# EAGLE design EFM_VCF_4622 (EAGLE 7.1.0)
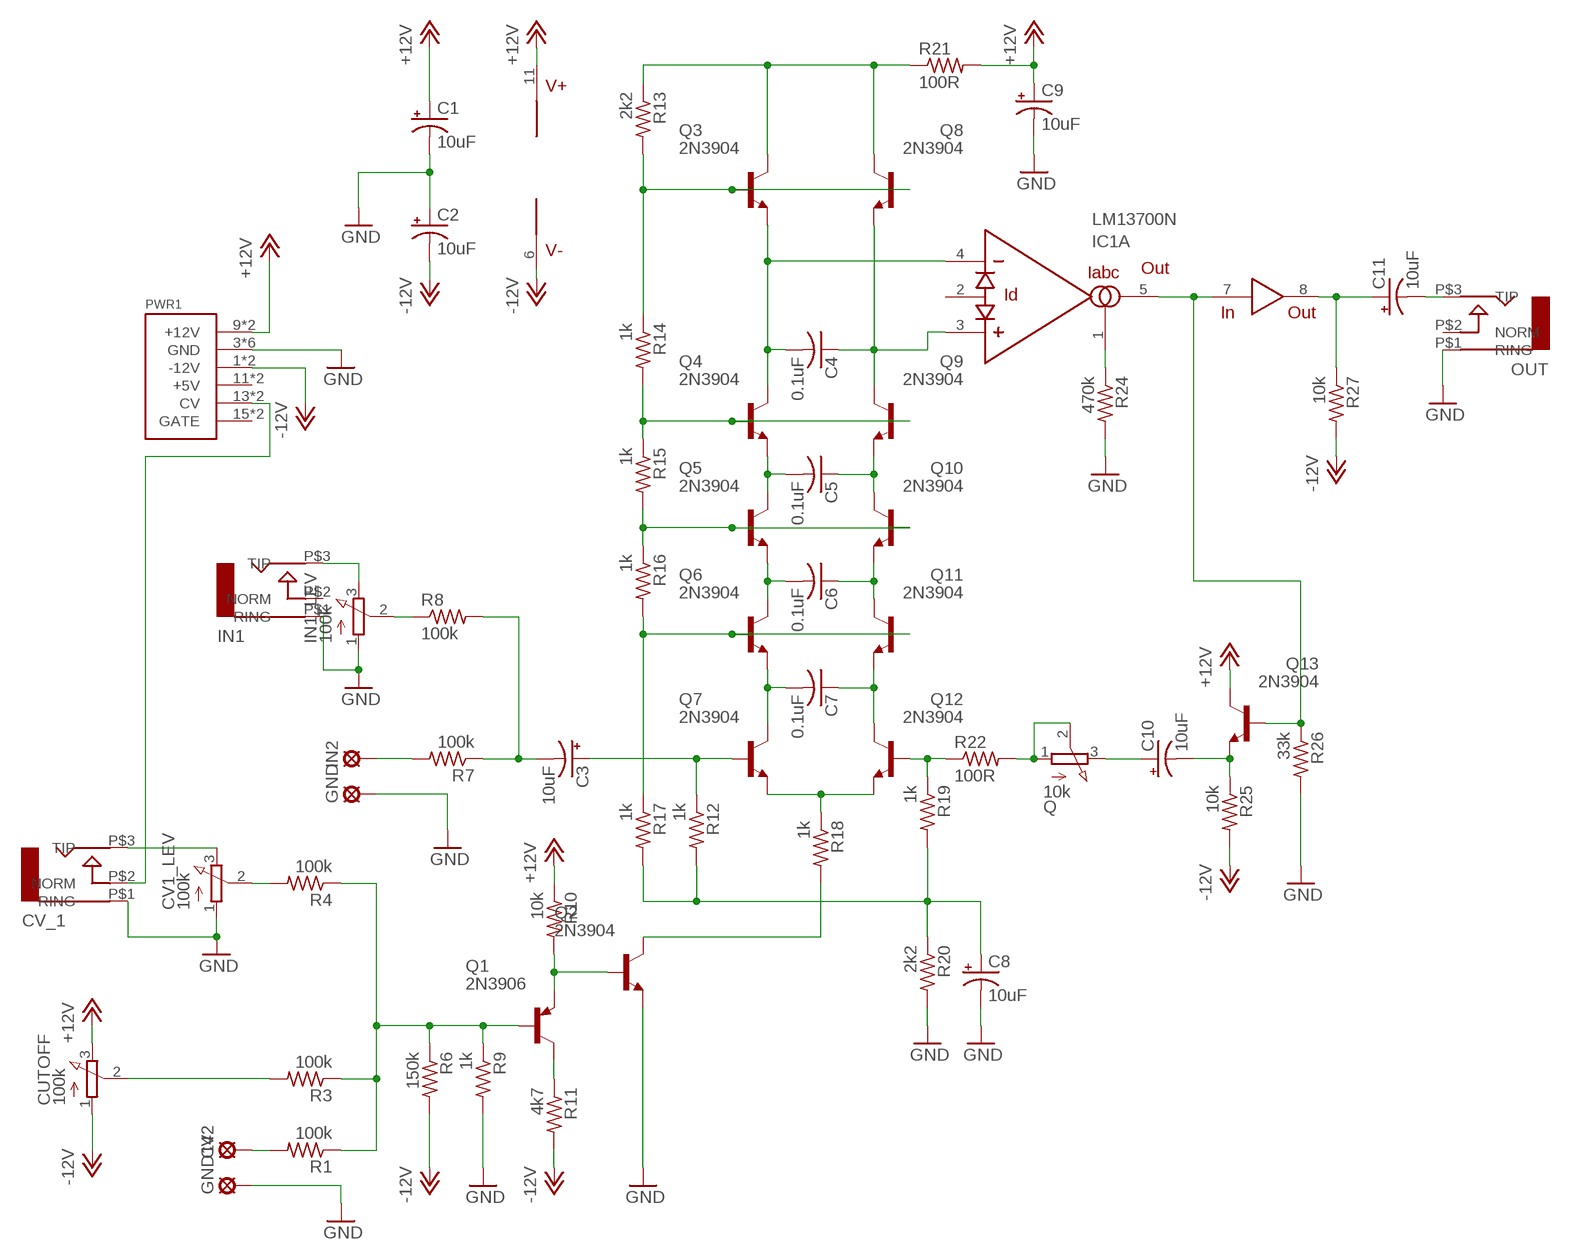
[diagram p0: schematic, sheet 1]

## Parts
C1  10uF  CPOL-USB45181A  [B45181A]
C2  10uF  CPOL-USB45181A  [B45181A]
C3  10uF  CPOL-USB45181A  [B45181A]
C4  0.1uF  C-US050-025X075  [C050-025X075]
C5  0.1uF  C-US050-025X075  [C050-025X075]
C6  0.1uF  C-US050-025X075  [C050-025X075]
C7  0.1uF  C-US050-025X075  [C050-025X075]
C8  10uF  CPOL-USB45181A  [B45181A]
C9  10uF  CPOL-USB45181A  [B45181A]
C10  10uF  CPOL-USB45181C  [B45181C]
C11  10uF  CPOL-USB45181B  [B45181B]
CUTOFF  100k  3RP/1610N  [3RP/1610N]
CV1_LEV  100k  3RP/1610N  [3RP/1610N]
CV2  LSP10  [LSP10]
CV_1  AUDIO-JACK  [ERTHENVAR-JACK-90DEG]
GND  LSP10  [LSP10]
GND14  LSP10  [LSP10]
IC1  LM13700N  [DIL16]
IN1  AUDIO-JACK  [ERTHENVAR-JACK-90DEG]
IN1_LEV  100k  3RP/1610N  [3RP/1610N]
IN2  LSP10  [LSP10]
OUT  AUDIO-JACK  [ERTHENVAR-JACK-90DEG]
PWR1  POWER  [POWER_16]
Q  10k  3RP/1610N  [3RP/1610N]
Q1  2N3906  [TO92]
Q2  2N3904  [TO92]
Q3  2N3904  [TO92]
Q4  2N3904  [TO92]
Q5  2N3904  [TO92]
Q6  2N3904  [TO92]
Q7  2N3904  [TO92]
Q8  2N3904  [TO92]
Q9  2N3904  [TO92]
Q10  2N3904  [TO92]
Q11  2N3904  [TO92]
Q12  2N3904  [TO92]
Q13  2N3904  [TO92]
R1  100k  R-US_0207/7  [0207/7]
R3  100k  R-US_0207/7  [0207/7]
R4  100k  R-US_0207/7  [0207/7]
R6  150k  R-US_0207/7  [0207/7]
R7  100k  R-US_0207/7  [0207/7]
R8  100k  R-US_0207/7  [0207/7]
R9  1k  R-US_0207/7  [0207/7]
R10  10k  R-US_0207/7  [0207/7]
R11  4k7  R-US_0207/7  [0207/7]
R12  1k  R-US_0207/7  [0207/7]
R13  2k2  R-US_0207/7  [0207/7]
R14  1k  R-US_0207/7  [0207/7]
R15  1k  R-US_0207/7  [0207/7]
R16  1k  R-US_0207/7  [0207/7]
R17  1k  R-US_0207/7  [0207/7]
R18  1k  R-US_0207/7  [0207/7]
R19  1k  R-US_0207/7  [0207/7]
R20  2k2  R-US_0207/7  [0207/7]
R21  100R  R-US_0207/7  [0207/7]
R22  100R  R-US_0207/7  [0207/7]
R24  470k  R-US_0207/7  [0207/7]
R25  10k  R-US_0207/7  [0207/7]
R26  33k  R-US_0207/7  [0207/7]
R27  10k  R-US_0207/7  [0207/7]

## Nets
+12V: C1.+ C9.+ CUTOFF.3(E) IC1.11(V+) PWR1.9(+12V) PWR1.10(+12V) Q13.1(C) R10.1 R21.2
-12V: C2.- CUTOFF.1(A) IC1.6(V-) PWR1.1(-12V) PWR1.2(-12V) R6.2 R11.2 R25.2 R27.2
GND: C1.- C2.+ C8.- C9.- CV1_LEV.1(A) CV_1.P$1(RING) GND14.MP GND.MP IN1.P$1(RING) IN1_LEV.1(A) OUT.P$1(RING) PWR1.3(GND) PWR1.4(GND) PWR1.5(GND) PWR1.6(GND) PWR1.7(GND) PWR1.8(GND) Q2.3(E) R9.2 R20.2 R24.2 R26.2
N$1: IC1.1(A:IABC) R24.1
N$2: Q.1(A) Q.2(S) R22.2
N$3: Q2.1(C) R18.2
N$4: Q7.3(E) Q12.3(E) R18.1
N$5: IN2.MP R7.2
N$6: C3.- R7.1 R8.2
N$7: C3.+ Q7.2(B) R12.1
N$8: Q1.3(E) Q2.2(B) R10.2
N$9: C4.2 IC1.4(A:-IN) Q3.3(E) Q4.1(C)
N$10: C10.+ Q.3(E)
N$11: CV2.MP R1.2
N$12: C4.1 IC1.3(A:+IN) Q8.3(E) Q9.1(C)
N$13: C6.1 Q10.3(E) Q11.1(C)
N$14: C5.2 Q4.3(E) Q5.1(C)
N$15: C5.1 Q9.3(E) Q10.1(C)
N$17: C7.1 Q11.3(E) Q12.1(C)
N$18: C7.2 Q6.3(E) Q7.1(C)
N$19: IC1.5(A:OUT) IC1.7(IN) Q13.2(B) R26.1
N$20: Q1.2(B) R1.1 R3.1 R4.1 R6.1 R9.1
N$25: C8.+ R12.2 R17.2 R19.2 R20.1
N$26: Q12.2(B) R19.1 R22.1
N$27: Q1.1(C) R11.1
N$28: C11.+ IC1.8(OUT) R27.1
N$29: C6.2 Q5.3(E) Q6.1(C)
N$31: C11.- OUT.P$3(TIP)
N$35: C10.- Q13.3(E) R25.1
N$43: Q3.1(C) Q8.1(C) R13.1 R21.1
N$44: Q3.2(B) Q8.2(B) R13.2 R14.1
N$46: Q4.2(B) Q9.2(B) R14.2 R15.1
N$49: Q5.2(B) Q10.2(B) R15.2 R16.1
N$50: Q6.2(B) Q11.2(B) R16.2 R17.1
N$53: CV1_LEV.2(S) R4.2
N$55: CV_1.P$2(NORM) PWR1.13(CV) PWR1.14(CV)
N$56: CUTOFF.2(S) R3.2
N$57: IN1_LEV.2(S) R8.1
N$58: IN1.P$3(TIP) IN1_LEV.3(E)
N$59: CV1_LEV.3(E) CV_1.P$3(TIP)
Unconnected: IC1.2(A:ID) IC1.9(OUT) IC1.10(IN) IC1.12(B:OUT) IC1.13(B:-IN) IC1.14(B:+IN) IC1.15(B:ID) IC1.16(B:IABC) IN1.P$2(NORM) OUT.P$2(NORM) PWR1.11(+5V) PWR1.12(+5V) PWR1.15(GATE) PWR1.16(GATE)

## Library data of the parts
C1-C3 C8-C11 = rcl:CPOL-US: POLARIZED CAPACITOR, American symbol
C4-C7 = rcl:C-US: CAPACITOR, American symbol
CUTOFF CV1_LEV IN1_LEV Q = pot:3RP/1610N: 16mm Potentiometer one level Source: http://www.alphapotentiometers.net/html/16mm_pot_2.html
CV2 GND GND14 IN2 = solpad:LSP10: SOLDER PAD drill 1.0 mm, distributor Buerklin, 12H555
CV_1 IN1 OUT = erthenvar:AUDIO-JACK: Switching Mono 3.5mm Audio Jack from Erthenvar.
IC1 = synthdiy updated imperial:LM13700: National Dual OTA with buffers.
PWR1 = eurorack:POWER
Q1 = transistor-pnp:2N3906: PNP Transistor
Q2-Q13 = transistor-npn:2N3904: NPN Transistor
R1 R3 R4 R6-R22 R24-R27 = rcl:R-US_: RESISTOR, American symbol

## Board
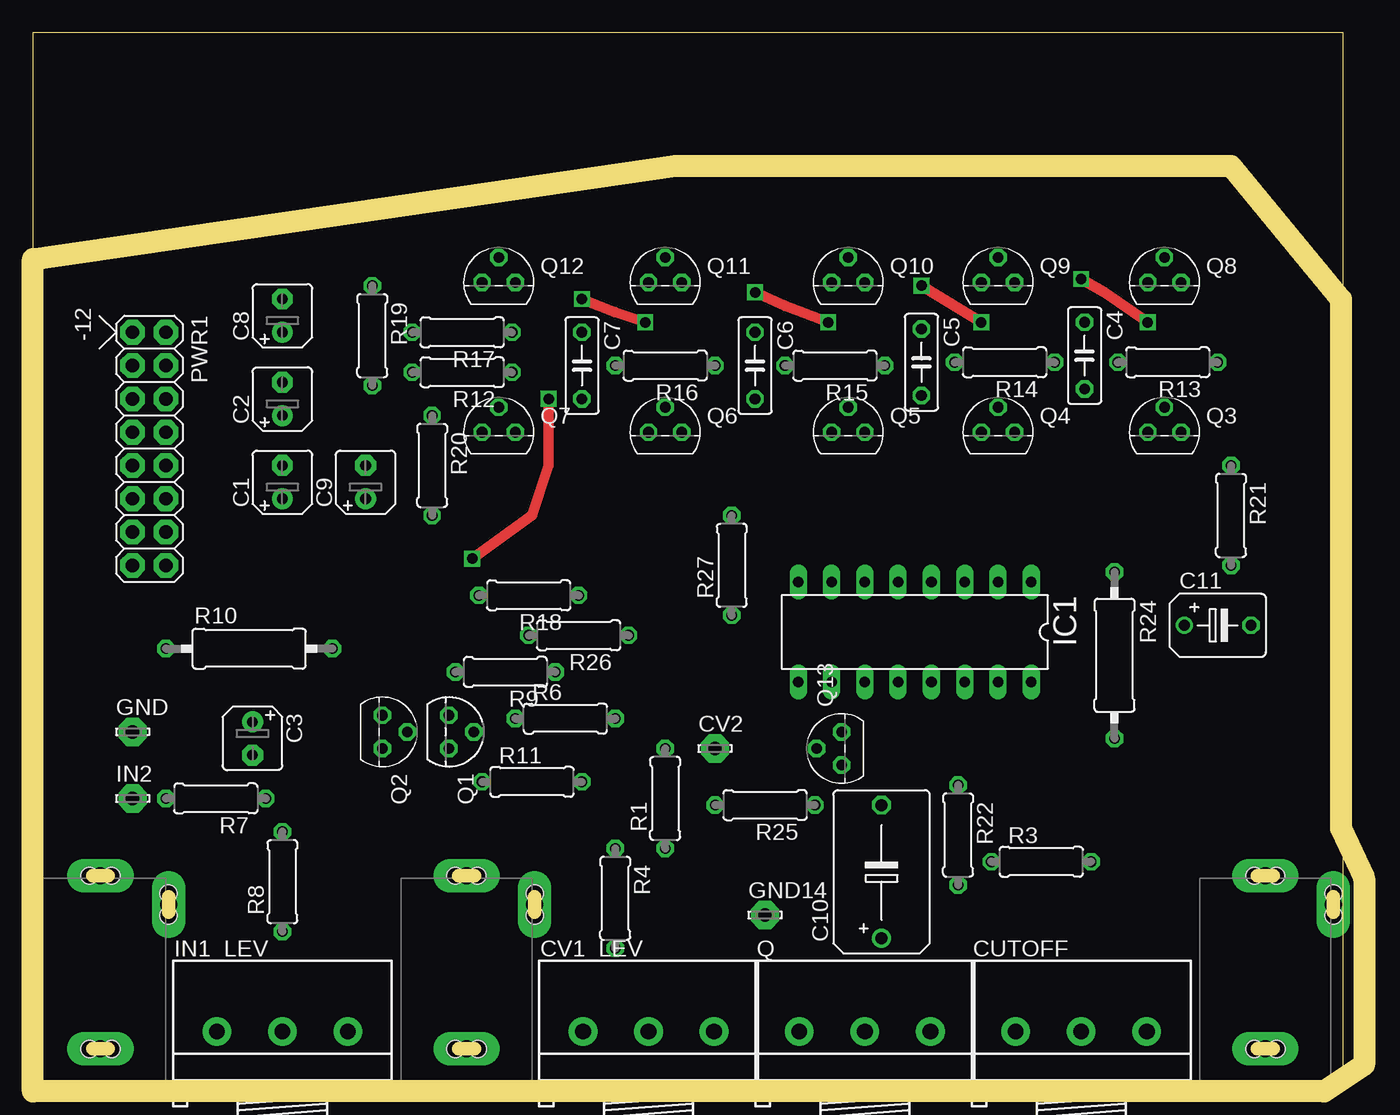
[diagram p1: board, top side]
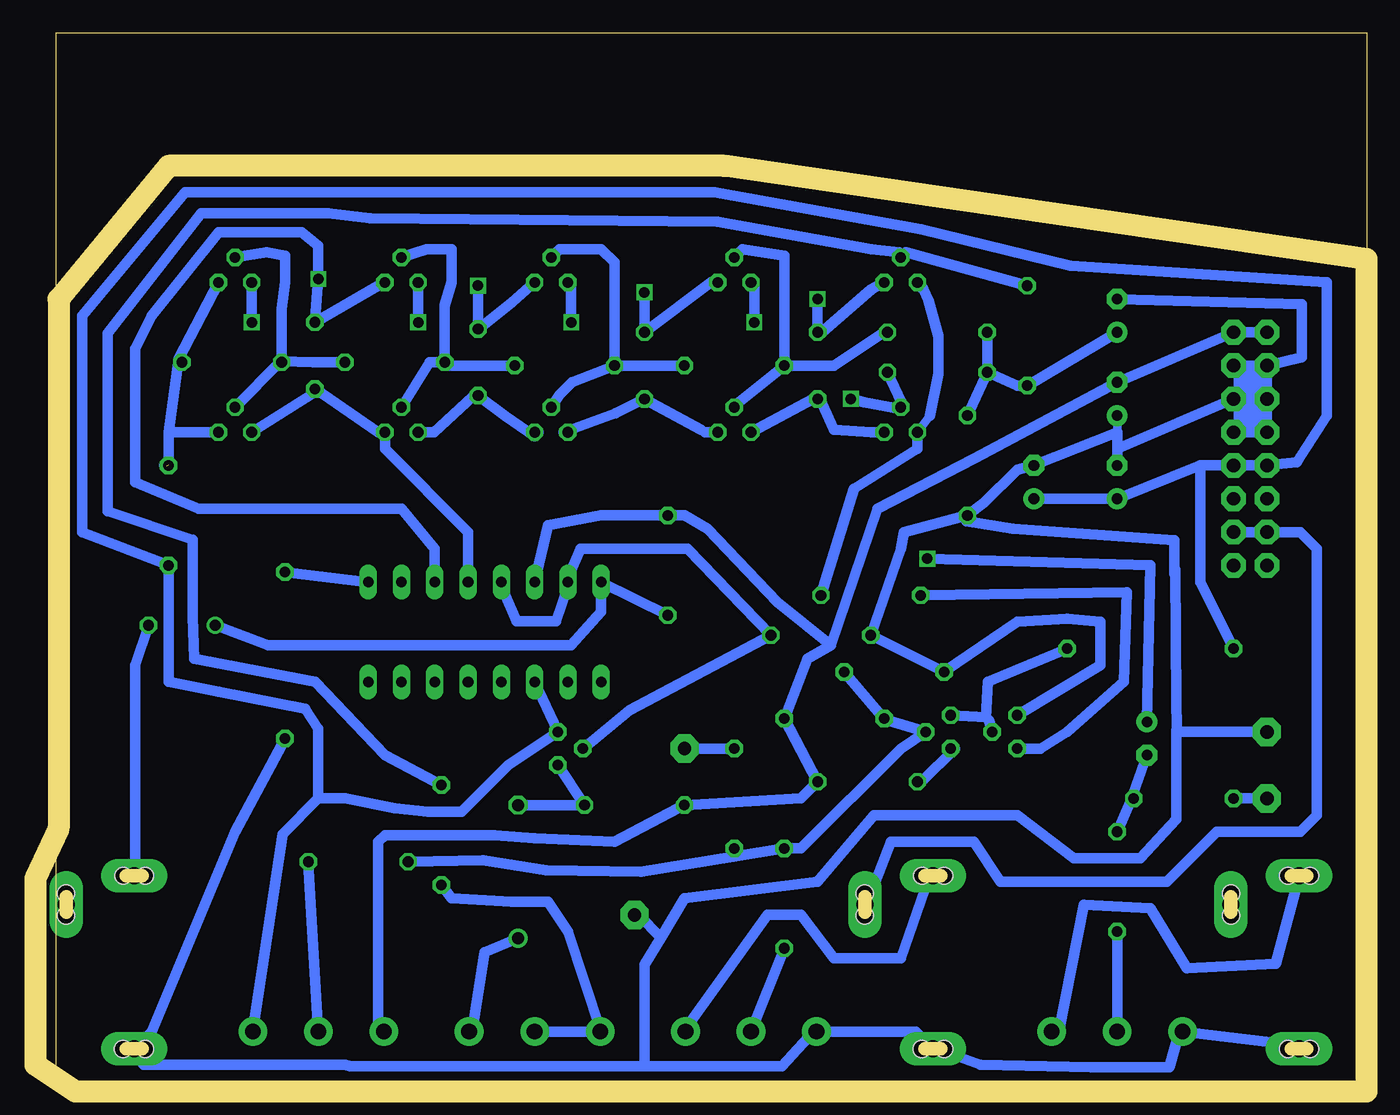
[diagram p2: board, bottom side, seen from below]

Size 100 x 80 mm. Coordinates in mm from the lower left corner, seen from the top.
Outline: 0,0 100,0 100,80 0,80 0,0
Copper layers (1*16): Top 0.035mm / dielectric 1.5mm / Bottom 0.035mm
Design rules "default *": minimum track width 26mil, minimum drill 31mil, track to track 16mil, track to pad 16mil, pad to pad 16mil, via to via 16mil, smd to smd 8mil, copper to edge 0mil, drill to drill 12mil, minimum pad ring 10mil, minimum via ring 8mil, stop-mask expansion 4mil, vias tented up to drill 0mil, thermal gap 10mil
Milling: 9 lines

### Footprints (pad centres in the part's own frame; a part is rotated, then mirrored left to right if it is on the bottom)
B45181A = drill 0.813 pad 1.6: + -1.27,0 | drill 0.813 pad 1.6 octagon: - 1.27,0
C050-025X075 = drill 0.813 octagon: 1 -2.54,0; 2 2.54,0
B45181C = drill 0.914: + -5.08,0 | drill 0.914 octagon: - 5.08,0
B45181B = drill 0.813: + -2.54,0 | drill 0.813 octagon: - 2.54,0
3RP/1610N = drill 1.2 pad 2.184: 1 -5,0; 2 0,0; 3 5,0
LSP10 = drill 1.016 pad 2.159 octagon: MP 0,0
ERTHENVAR-JACK-90DEG = drill 1.3 pad 2.54 long: P$1 5,-2.5; P$2 -0.2,-13.5; P$3 5,-15.7 | hole 1.3: 5.842,-2.489; 4.14,-2.489; -0.203,-12.649; -0.203,-14.351; 5.842,-15.697; 4.166,-15.697
DIL16 = drill 0.813 long: 1 -8.89,-3.81; 2 -6.35,-3.81; 3 -3.81,-3.81; 4 -1.27,-3.81; 5 1.27,-3.81; 6 3.81,-3.81; 7 6.35,-3.81; 8 8.89,-3.81; 9 8.89,3.81; 10 6.35,3.81; 11 3.81,3.81; 12 1.27,3.81; 13 -1.27,3.81; 14 -3.81,3.81; 15 -6.35,3.81; 16 -8.89,3.81
POWER_16 = drill 1.016 pad 1.88 octagon: 1 -6.35,-1.27; 2 -6.35,1.27; 3 -3.81,-1.27; 4 -3.81,1.27; 5 -1.27,-1.27; 6 -1.27,1.27; 7 1.27,-1.27; 8 1.27,1.27; 9 3.81,-1.27; 10 3.81,1.27; 11 6.35,-1.27; 12 6.35,1.27; 13 8.89,-1.27; 14 8.89,1.27; 15 11.43,-1.27; 16 11.43,1.27
TO92 = drill 0.813 octagon: 1 1.27,0; 2 0,1.905; 3 -1.27,0
0207/7 = drill 0.813 octagon: 1 -3.81,0; 2 3.81,0
0309/12 = drill 0.813 octagon: 1 -6.35,0; 2 6.35,0

### Placement (x,y rotation side)
C1  19.05,45.72 90 top
C2  19.05,52.07 90 top
C3  16.76,26.16 270 top
C4  80.26,55.37 270 top
C5  67.82,54.86 270 top
C6  55.12,54.61 270 top
C7  41.91,54.61 270 top
C8  19.05,58.42 90 top
C9  25.4,45.72 90 top
C10  64.77,16 90 top
C11  90.42,34.8 0 top
CUTOFF  80.01,3.81 0 top
CV1_LEV  46.99,3.81 0 top
CV2  52.07,25.4 0 top
CV_1  38.1,0 180 top
GND  7.62,26.67 0 top
GND14  55.88,12.7 0 top
IC1  67.31,34.29 180 top
IN1  10.16,0 180 top
IN1_LEV  19.05,3.81 0 top
IN2  7.62,21.59 0 top
OUT  99.06,0 180 top
PWR1  8.89,50.8 270 top
Q  63.5,3.81 0 top
Q1  31.75,26.67 270 top
Q2  26.67,26.67 270 top
Q3  86.36,49.53 0 top
Q4  73.66,49.53 0 top
Q5  62.23,49.53 0 top
Q6  48.26,49.53 0 top
Q7  35.56,49.53 0 top
Q8  86.36,60.96 0 top
Q9  73.66,60.96 0 top
Q10  62.23,60.96 0 top
Q11  48.26,60.96 0 top
Q12  35.56,60.96 0 top
Q13  61.72,25.4 90 top
R1  48.26,21.59 90 top
R3  76.96,16.76 0 top
R4  44.45,13.97 270 top
R6  40.64,27.69 0 top
R7  13.97,21.59 180 top
R8  19.05,15.24 90 top
R9  36.07,31.24 180 top
R10  10k  [0309/12]  16.51,33.02 0 top
R11  38.1,22.86 0 top
R12  32.77,54.1 180 top
R13  86.61,54.86 180 top
R14  74.17,54.86 180 top
R15  61.21,54.61 180 top
R16  48.26,54.61 180 top
R17  32.77,57.15 180 top
R18  37.85,37.08 180 top
R19  25.91,56.9 270 top
R20  30.48,46.99 270 top
R21  91.44,43.18 270 top
R22  70.61,18.8 270 top
R24  470k  [0309/12]  82.55,32.51 270 top
R25  55.88,21.08 180 top
R26  41.66,34.04 180 top
R27  53.34,39.37 90 top

### Tracks (layer width: path | path; a pad name or v marks a point on that pad's centre or on a via)
+12V
  Bottom 0.813: 12.7,46.99 PWR1.10 PWR1.9 5.33,47.24 3.05,50.8 3.05,60.96 22.61,62.23 34.04,65.02 49.78,67.82 90.17,67.82 98.04,58.42 98.04,41.91 R21.2 91.44,30.48 87.63,29.72 81.03,28.45 80.01,26.92 80.01,21.59 | 12.7,46.99 12.7,38.1 R10.1 | 12.7,46.99 C1.+ C9.+ | IC1.11 Q13.1 65.53,24.13 69.09,20.57 71.63,20.57 74.17,20.83 77.98,21.59 80.01,21.59 | CUTOFF.3 82.72,18.88 80.01,21.59
-12V
  Bottom 0.813: PWR1.1 PWR1.2 C2.- 29.97,47.5 37.34,43.69 40.89,33.27 | 40.89,33.27 42.67,32.26 R6.2 R11.2 43.18,21.59 R25.2 52.58,20.83 57.4,18.29 63.5,18.54 66.55,18.8 74.93,18.8 75.44,18.29 75.44,4.06 | 40.89,33.27 44.96,36.58 50.29,42.16 52.07,43.18 R27.2 58.42,43.18 62.48,42.42 IC1.6 | 75.44,4.06 74.68,3.3 | 75.44,4.06 75.26,4.06 CUTOFF.1
GND
  Bottom 0.66: C2.+ 19.05,49.53 | 14.29,3.81 IN1_LEV.1 | 42.23,3.81 CV1_LEV.1
  Bottom 0.813: 19.05,48.26 19.05,49.53 C9.- 26.67,46.67 29.21,44.13 R20.2 | 19.05,48.26 C1.- | PWR1.5 PWR1.7 PWR1.8 | PWR1.5 PWR1.6 19.05,48.26 | C8.- 4.95,59.31 4.95,55.24 PWR1.3 | PWR1.3 PWR1.4 | PWR1.3 PWR1.5 | R20.2 30.54,42.74 26.99,42.16 14.67,41.27 14.67,38.73 14.61,39.05 14.54,28.89 14.51,27.15 14.52,26.68 | 14.29,3.81 15.05,1.08 21.02,1.08 29.46,1.27 33.02,2.58 CV_1.P$1 34.41,3.81 CV1_LEV.1 | 14.52,26.68 14.54,25.4 14.54,20 17.27,17.02 22.35,17.02 26.67,20.32 37.59,20.32 41.91,15.24 52.07,13.97 53.86,10.98 | 55.12,1.14 44.64,1.14 42.23,3.81 | 55.12,1.14 77.6,1.14 77.98,1.27 93.34,1.27 OUT.P$1 93.98,2.58 92.71,3.81 86.36,19.05 R24.2 | IN1_LEV.1 5.71,2.79 IN1.P$1 | R20.2 35.31,41.91 35.56,40.64 R26.2 R9.2 26.67,35.05 22.86,35.31 20.32,35.05 20.32,31.75 Q2.3 | 53.86,10.98 55.12,8.89 55.12,1.14 | GND.MP 14.51,26.67 14.52,26.68 | GND14.MP 55.58,12.7 53.86,10.98
N$1
  Bottom 0.813: R24.1 IC1.1
N$2
  Bottom 0.66: 58.42,3.81 Q.1
  Bottom 0.813: Q.1 Q.2 | 58.42,3.81 60.96,11.43 62.48,13.72 65.28,13.72 69.85,13.97 R22.2
N$3
  Bottom 0.813: R18.2 18.29,37.34 18.54,30.48 22.86,26.67 24.89,25.4 Q2.1
N$4
  Bottom 0.66: 33.34,50.8 Q7.3
  Bottom 0.813: 33.34,50.8 32.7,53.98 32.7,56.83 33.43,59.59 33.85,60.45 Q12.3 | R18.1 39.12,45.21 34.29,48.26 Q7.3
N$5
  Bottom 0.813: IN2.MP R7.2
N$6
  Bottom 0.66: 18.03,21.34 R7.1
  Bottom 0.813: C3.- 18.03,21.34 R8.2
N$7  (via drill 0.8 pad 0.81)
  Top 0.813: v33.53,39.88 38.1,43.18 39.37,46.99 v39.37,52.07
  Bottom 0.813: R12.1 35.5,51.82 35.53,51.28 | 35.53,51.28 35.43,51.37 Q7.2 | C3.+ 16.51,39.37 v33.53,39.88 | v39.37,52.07 38.35,51.82 35.53,51.28
N$8
  Bottom 0.813: Q2.2 28.83,27.56 29.05,27.78 | Q1.3 29.05,27.78 | R10.2 28.89,30.48 29.05,27.78
N$9
  Bottom 0.813: IC1.4 68.58,41.91 74.93,48.26 Q4.1 75.44,49.53 C4.2 80.26,52.58 Q3.3
N$10
  Bottom 0.66: 68.26,3.81 Q.3
  Bottom 0.813: C10.+ 67.31,9.84 68.26,3.81
N$11
  Bottom 0.813: R1.2 CV2.MP
N$12  (via drill 0.8)
  Top 0.813: v80.01,61.21 81.79,60.2 v85.09,57.91
  Bottom 0.813: Q9.1 75.44,60.71 C4.1 80.26,58.17 v80.01,61.21 80.01,63.75 81.28,64.77 87.63,64.77 92.71,58.42 93.98,55.88 93.98,45.72 89.15,43.69 73.66,43.69 71.12,40.64 IC1.3 | v85.09,57.91 Q8.3
N$13  (via drill 0.8)
  Top 0.813: v55.12,60.2 57.4,59.18 v60.71,57.91
  Bottom 0.813: Q11.1 50.04,60.96 C6.1 v55.12,60.2 | v60.71,57.91 60.71,60.71 Q10.3
N$14
  Bottom 0.66: 63.18,49.53 Q5.1
  Bottom 0.813: 63.18,49.53 63.5,49.21 65.72,50.74 C5.2 68.23,52.23 71.18,49.53 Q4.3
N$15  (via drill 0.8)
  Top 0.813: v67.82,60.71 69.09,59.94 v72.39,57.91
  Bottom 0.813: Q10.1 65.22,59.44 67.75,57.4 C5.1 v67.82,60.71 | v72.39,57.91 Q9.3
N$17  (via drill 0.8)
  Top 0.813: v41.91,59.69 44.45,58.67 v46.74,57.91
  Bottom 0.813: Q12.1 37.78,60.45 41.59,57.15 C7.1 v41.91,59.69 | v46.74,57.91 46.74,60.71 Q11.3
N$18
  Bottom 0.66: C7.2 41.59,51.75 | 42.23,52.07 42.07,52.23
  Bottom 0.813: Q7.1 37.78,49.53 40.64,49.72 41.59,51.75 42.07,52.23 | 42.23,52.07 Q6.3
N$19
  Bottom 0.66: 60.96,38.42 IC1.7 60.96,37.78 | IC1.5 65.85,37.66 65.85,37.34
  Bottom 0.813: 60.96,38.42 60.01,40.64 51.82,40.64 R26.1 56.26,28.32 Q13.2 | 65.85,37.34 64.9,35.12 61.85,35.12 60.96,37.78
N$20
  Bottom 0.813: R9.1 R6.1 36.83,27.62 34.67,26.99 Q1.2 35.56,25.4 43.18,17.78 R4.1 48.36,17.14 | 48.36,17.14 55.37,16 62.61,16.13 67.44,16.89 R3.1 | R1.1 48.26,17.25 48.36,17.14
N$25
  Bottom 0.813: R20.1 R12.2 | C8.+ R19.2 26.67,53.09 R12.2 | R12.2 R17.2
N$26
  Bottom 0.813: R22.1 74.93,24.89 80.26,30.48 89.47,32.26 89.6,35.43 89.6,41.34 96.08,43.5 96.08,57.09 88.96,66.23 79.25,66.23 76.07,65.85 49.53,65.6 37.78,63.5 35.69,63.25 Q12.2 35.18,63.25 R19.1
N$27
  Bottom 0.813: Q1.1 31.43,25.4 33.97,22.86 R11.1
N$28
  Bottom 0.813: R27.1 IC1.8 58.42,35.81 60.71,33.27 83.82,33.27 C11.+
N$29
  Bottom 0.813: Q6.1 50.48,49.53 50.8,49.72 55.05,52.01 C6.2 57.31,50.96 61.28,49.53 Q5.3
N$31
  Bottom 0.813: C11.- 93.98,31.75 93.98,15.62 OUT.P$3
N$35
  Bottom 0.813: C10.- R25.1 Q13.3
N$43  (1 unrouted)
  Bottom 0.813: 91.76,46.99 91.57,46.93 | Q8.1 90.68,55.12 | 90.68,55.12 91.44,49.53 | 91.44,49.53 R21.1 | Q3.1 91.44,49.53 | 90.68,55.12 R13.1
N$44
  Bottom 0.813: R14.1 80.39,54.86 82.87,54.93 | 82.87,54.93 Q3.2 | 82.87,54.93 R13.2 82.8,58.93 82.55,60.96 82.55,62.99 83.95,63.25 Q8.2
N$46
  Bottom 0.813: R15.1 70.1,54.61 R14.2 | R14.2 70.36,59.18 69.85,60.96 69.85,63.5 71.75,63.5 Q9.2 | R14.2 71.5,54.86 Q4.2
N$49
  Bottom 0.813: R15.2 R16.1 | Q5.2 61.59,52.39 60.64,53.34 R15.2 | R15.2 57.4,62.48 58.42,63.5 61.59,63.5 Q10.2
N$50
  Bottom 0.813: Q6.2 48.26,51.56 R16.2 | R16.2 44.45,62.99 47.62,63.5 Q11.2 | R17.1 36.83,57.15 40.64,54.61 R16.2
N$53
  Bottom 0.813: CV1_LEV.2 R4.2
N$55
  Bottom 0.66: PWR1.14 PWR1.13
  Bottom 0.813: PWR1.14 5.08,41.91 3.81,40.64 3.81,20.32 5.08,19.05 11.43,19.05 15.24,15.24 27.94,15.24 29.97,18.29 36.32,18.29 37.5,15.24 CV_1.P$2
N$56
  Bottom 0.813: CUTOFF.2 R3.2
N$57
  Bottom 0.813: IN1_LEV.2 R8.1
N$58
  Bottom 0.813: IN1.P$3 6.94,8.97 13.72,8.64 16.51,13.21 21.59,13.46 23.5,3.81 IN1_LEV.3
N$59
  Bottom 0.813: CV_1.P$3 33.1,16.43 35.56,9.4 40.64,9.4 43.18,12.7 45.72,12.7 52.07,3.89 CV1_LEV.3
(copper drawn outside any net)
  shapes: Bottom area x1